# EAGLE design encoder-switch-type2-smd (EAGLE 9.2.0)
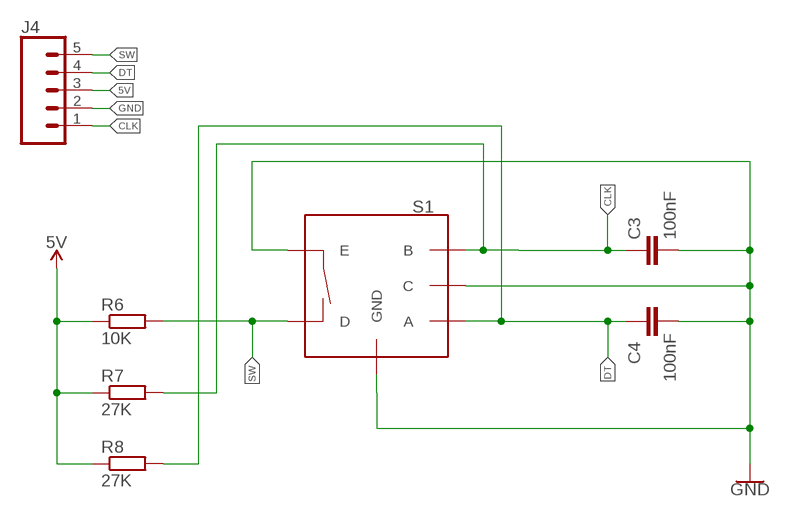
[diagram p0: schematic, sheet 1]

## Parts
C3  100nF  C-EUC1206  [C1206]
C4  100nF  C-EUC1206  [C1206]
J4  CONN_051X05LA  [1X05/90]
R6  10K  R-EU_R1206  [R1206]
R7  27K  R-EU_R1206  [R1206]
R8  27K  R-EU_R1206  [R1206]
S1  ENCODER_SWITCH  [ROTARY_ENC_PLAIN]

## Nets
5V: J4.3 R6.1 R7.1 R8.1
CLK: C3.1 J4.1 R7.2 S1.B
DT: C4.1 J4.4 R8.2 S1.A
GND: C3.2 C4.2 J4.2 S1.C S1.E S1.GND1(GND) S1.GND2(GND)
SW: J4.5 R6.2 S1.D

## Library data of the parts
C3 C4 = rcl:C-EU: CAPACITOR, European symbol; SPICEPREFIX: C
J4 = 001-private-inventory:CONN_05: Multi connection point. Often used as Generic Header-pin footprint for 0.1 inch spaced/style header connections On any of the 0.1 inch spaced packages, you can populate with these: Break Away Headers - Straight <https://www.sparkfun.com/products/116> (PRT-00116) Break Away Male Headers - Right Angle <https://www.sparkfun.com/products/553> (PRT-00553) Female Headers <https://www.sparkfun.com/products/115> (PRT-00115) Break Away Headers - Machine Pin <https://www.sparkfun.com/products/117> (PRT-00117) Break Away Female Headers - Swiss Machine Pin <https://www.sparkfun.com/products/743> (PRT-00743) For SCREWTERMINALS and SPRING TERMINALS visit here: Screw Terimnals on SparkFun.com <https://www.sparkfun.com/search/results?term=Screw+Terminals> (5mm/3.5mm/2.54mm spacing) This device is also useful as a general connection point to wire up your design to another part of your project. Our various solder wires solder well into these plated through hole pads. Hook-Up Wire - Assortment (Stranded, 22 AWG) <https://www.sparkfun.com/products/11375> (PRT-11375) Hook-Up Wire - Assortment (Solid Core, 22 AWG) <https://www.sparkfun.com/products/11367> (PRT-11367) View the entire wire category on our website here <https://www.sparkfun.com/categories/141> Special notes: Molex polarized connector foot print use with SKU : PRT-08231 with associated crimp pins and housings. 1MM SMD Version SKU: PRT-10208
R6-R8 = rcl:R-EU_: RESISTOR, European symbol; SPICEPREFIX: R
S1 = 010-inputs:ENCODER_SWITCH: Rotary Encoder w/ Select Switch Encoders rotate similarly to potentiometers, but they’re different from potentiometers in that an encoder has full rotation without limits. They output gray code so that you can tell how much and in which direction the encoder has been turned. This encoder includes a push-down select switch built into the shaft. SparkFun Products Rotary Encoder <https://www.sparkfun.com/products/9117> (COM-09117); SF_SKU: COM-09117

## Board
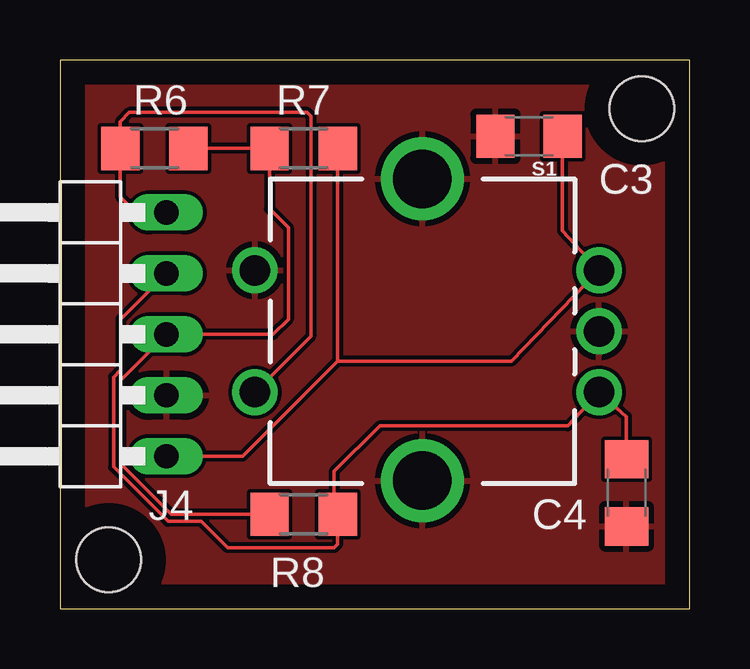
[diagram p1: board, top side]
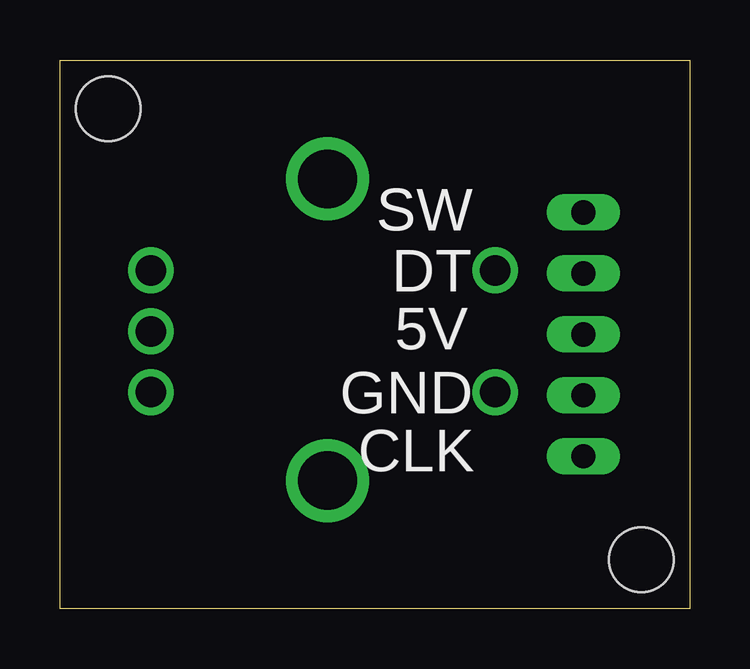
[diagram p2: board, bottom side, seen from below]

Size 26.27 x 22.86 mm. Coordinates in mm from the lower left corner, seen from the top.
Outline: 0,0 26.27,0 26.27,22.86 0,22.86 0,0
Copper layers (1*16): Top 0.035mm / dielectric 1.5mm / Bottom 0.035mm
Design rules "default": minimum track width 6mil, minimum drill 0.35mm, track to track 6mil, track to pad 6mil, pad to pad 6mil, via to via 6mil, smd to smd 6mil, copper to edge 40mil, drill to drill 6mil, minimum pad ring 10mil, minimum via ring 8mil, stop-mask expansion 4mil, vias tented up to drill 0mil, thermal gap 10mil
Holes 2.7 mm at 2.03,2.03 24.26,20.83

### Footprints (pad centres in the part's own frame; a part is rotated, then mirrored left to right if it is on the bottom)
C1206 = smd 1.6 x 1.8: 1 -1.4,0; 2 1.4,0
1X05/90 = drill 1.016 long: 1 -5.08,-3.81; 2 -2.54,-3.81; 3 0,-3.81; 4 2.54,-3.81; 5 5.08,-3.81
R1206 = smd 1.6 x 1.803: 1 -1.422,0; 2 1.422,0
ROTARY_ENC_PLAIN = drill 1.27: A 7.366,-2.54; B 7.366,2.54; C 7.366,0; D -6.985,-2.54; E -6.985,2.54 | drill 2.438: GND1 0,6.35; GND2 0,-6.223

### Placement (x,y rotation side)
C3  19.56,19.68 180 top
C4  23.62,4.83 270 top
J4  0.64,11.43 90 top
R6  3.94,19.18 180 top
R7  10.16,19.18 0 top
R8  10.16,3.94 0 top
S1  15.11,11.56 0 top

### Tracks (layer width: path | path; a pad name or v marks a point on that pad's centre or on a via)
5V
  Top 0.152: R6.1 R7.1 8.74,16.66 9.53,15.88 9.53,12.06 8.89,11.43 J4.3 2.54,9.53 2.54,6.03 4.64,3.94 R8.1
CLK
  Top 0.152: R7.2 11.58,10.31 | 11.58,10.31 7.62,6.35 J4.1 | C3.1 20.96,15.74 S1.B 18.82,10.31 11.58,10.31
DT
  Top 0.152: C4.1 23.62,8 S1.A 21.17,7.62 13.34,7.62 11.43,5.71 11.43,4.09 R8.2 11.58,2.69 11.43,2.54 6.99,2.54 5.89,3.63 4.51,3.63 2.23,5.91 2.23,9.65 2.54,9.96 2.54,12.06 J4.4
GND
  pour Top: 0,22.86 26.29,22.86 26.29,0 0,0
SW
  Top 0.152: J4.5 3.17,16.51 2.52,17.17 R6.2 2.52,20.3 2.9,20.68 10.31,20.68 10.46,20.52 10.46,11.35 S1.D

### Text on the board
bPlace: SW | DT | 5V | GND | CLK